# Altium schematic sheet TIDA01398_POWER_PIR.SchDoc: Power and PIR Sensor
size 431 x 279 mm; Date: Not shown in title block; ApprovedBy: Not shown in title block; CheckedBy: Not shown in title block; Author: Not shown in title block; CompanyName: Not shown in title block; DrawnBy: David Stout; Engineer: David Stout; Organization: Not shown in title block; Address1: Not shown in title block; Address2: Not shown in title block; Address3: Not shown in title block; Address4: Not shown in title block; DocumentNumber: 1; Revision: Use project parameter SCH_Rev; SheetNumber: 2; SheetTotal: 4; PageSetup: Record=PageOptions|CenterHorizontal=True|CenterVertical=True|PrintScale=0.62|XCorrection=1.00|YCorrection=1.00|PrintKind=0|BorderSize=5000000|LeftOffset=0|BottomOffset=0|Orientation=2|PaperLength=1000|PaperWidth=1000|Scale=100|PaperSource=15|PrintQuality=600|MediaType=1|DitherType=10|PrintScaleMode=1|PaperKind=Letter (8.5 x 11")|PaperIndex=1; CurrentTime: Not shown in title block; CurrentDate: Not shown in title block; Time: Not shown in title block; DocumentFullPathAndName: Not shown in title block; DocumentName: Not shown in title block; ModifiedDate: Not shown in title block; ImagePath: Not shown in title block
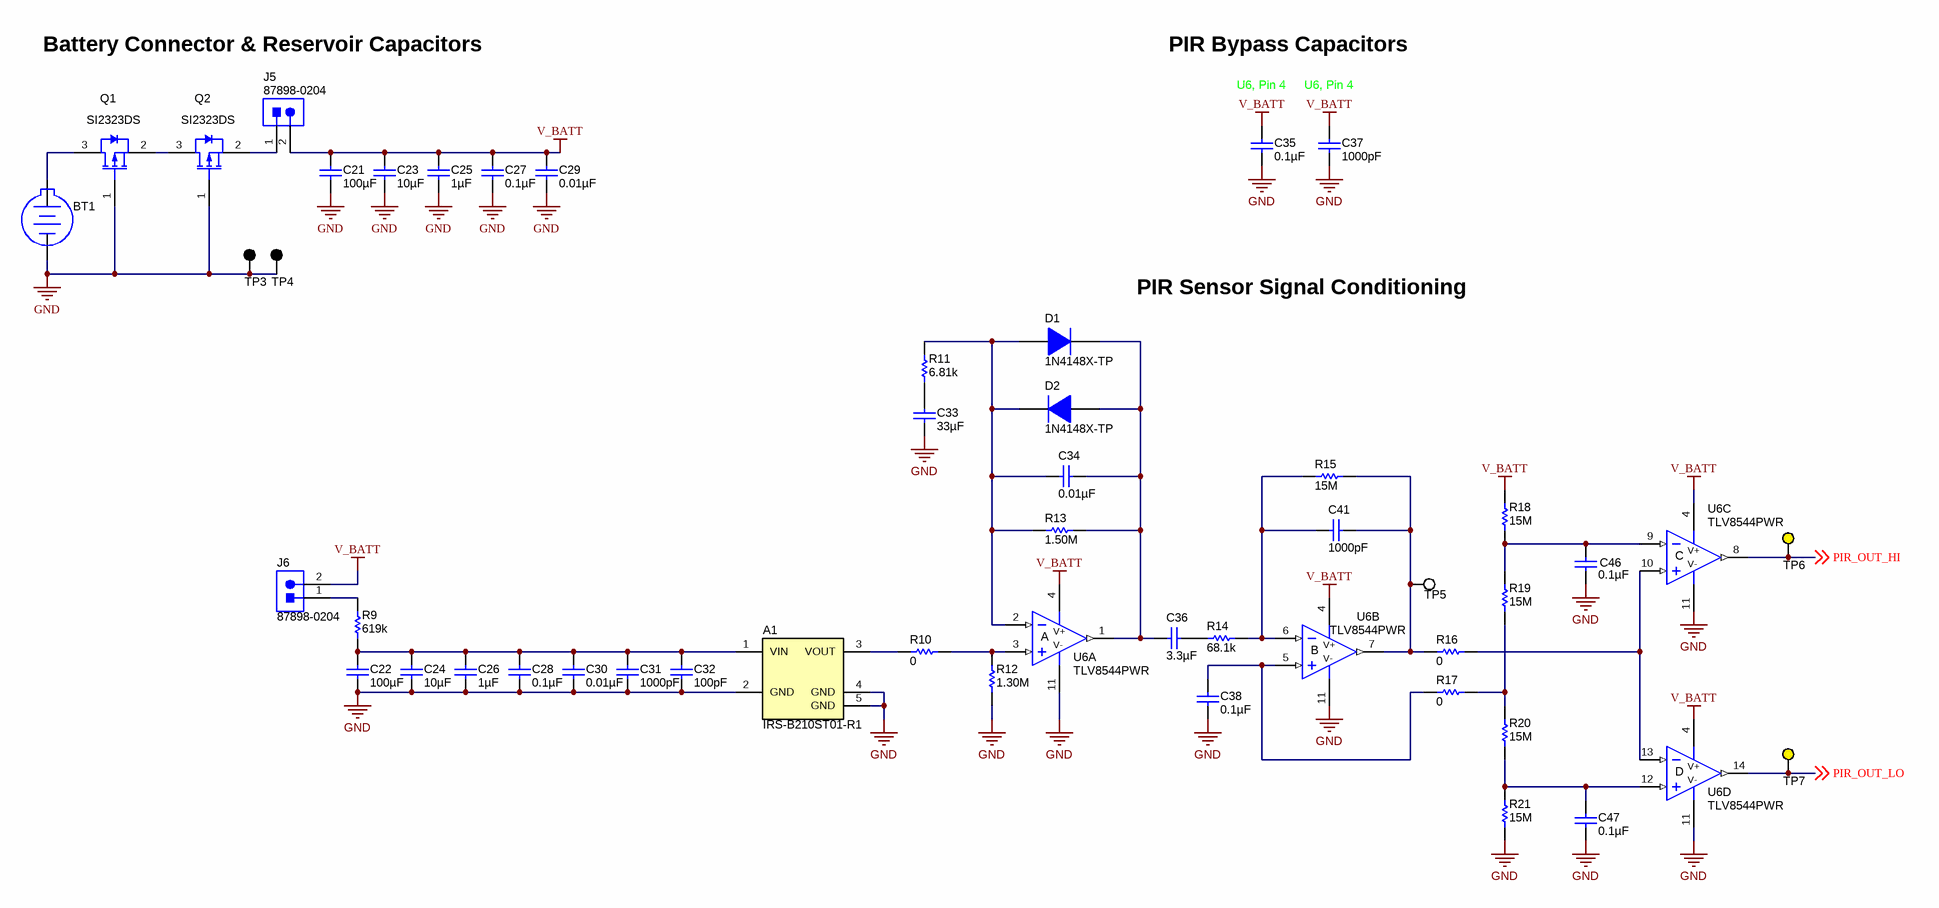
[diagram p0: TIDA01398_POWER_PIR.SchDoc]

## Parts
A1  IRS-B210ST01-R1  [Murata_IRS-B210ST01]
BT1  BS-7  [BAT_BS-7]  (value not drawn)
C21  ValueDisplayed: 100µF  [1206_190]  (hidden comment: C3216X5R1A107M160AC)
C22  ValueDisplayed: 100µF  [1206_190]  (hidden comment: C3216X5R1A107M160AC)
C23  ValueDisplayed: 10µF  [0603]  (hidden comment: C1608X5R0J106M)
C24  ValueDisplayed: 10µF  [0402]  (hidden comment: GRM155R60J106ME44D)
C25  ValueDisplayed: 1µF  [0603]  (hidden comment: C1608X7R1C105K)
C26  ValueDisplayed: 1µF  [0402]  (hidden comment: C1005X5R1A105K050BB)
C27  ValueDisplayed: 0.1µF  [0402]  (hidden comment: C1005X7R1H104K050BB)
C28  ValueDisplayed: 0.1µF  [0402]  (hidden comment: C1005X7R1H104K050BB)
C29  ValueDisplayed: 0.01µF  [0402]  (hidden comment: C1005X7R1C103K050BA)
C30  ValueDisplayed: 0.01µF  [0402]  (hidden comment: C1005X7R1C103K050BA)
C31  ValueDisplayed: 1000pF  [0402]  (hidden comment: C1005X7R1H102K)
C32  ValueDisplayed: 100pF  [0402]  (hidden comment: C0402C101J3GACTU)
C33  ValueDisplayed: 33µF  [0805_HV]  (hidden comment: C2012X5R1A336M125AC)
C34  ValueDisplayed: 0.01µF  [0402]  (hidden comment: C1005X7R1E103K)
C35  ValueDisplayed: 0.1µF  [0402]  (hidden comment: C1005X7R1H104K)
C36  ValueDisplayed: 3.3µF  [0402]  (hidden comment: C1005X5R1A335K050BC)
C37  ValueDisplayed: 1000pF  [0402]  (hidden comment: C1005X7R1H102K)
C38  ValueDisplayed: 0.1µF  [0402]  (hidden comment: C1005X7R1H104K)
C41  ValueDisplayed: 1000pF  [0402]  (hidden comment: C1005C0G1E102J)
C46  ValueDisplayed: 0.1µF  [0402]  (hidden comment: C1005X7R1H104K)
C47  ValueDisplayed: 0.1µF  [0402]  (hidden comment: C1005X7R1H104K)
D1  1N4148X-TP  [SOD-523]
D2  1N4148X-TP  [SOD-523]
J5  87898-0204  [Molex_87898-0204]
J6  87898-0204  [Molex_87898-0204]
Q1  SI2323DS  [SOT-23]
Q2  SI2323DS  [SOT-23]
R9  ValueDisplayed: 619k  [0402]  (hidden comment: CRCW0402619KFKED)
R10  ValueDisplayed: 0  [0402]  (hidden comment: CRCW04020000Z0ED)
R11  ValueDisplayed: 6.81k  [0402]  (hidden comment: CRCW04026K81FKED)
R12  ValueDisplayed: 1.30M  [0402]  (hidden comment: CRCW04021M30FKED)
R13  ValueDisplayed: 1.50M  [0402]  (hidden comment: CRCW04021M50FKED)
R14  ValueDisplayed: 68.1k  [0402]  (hidden comment: CRCW040268K1FKED)
R15  ValueDisplayed: 15M  [0805_HV]  (hidden comment: RMCF0805JT15M0)
R16  ValueDisplayed: 0  [0402]  (hidden comment: CRCW04020000Z0ED)
R17  ValueDisplayed: 0  [0402]  (hidden comment: CRCW04020000Z0ED)
R18  ValueDisplayed: 15M  [0805_HV]  (hidden comment: RMCF0805JT15M0)
R19  ValueDisplayed: 15M  [0805_HV]  (hidden comment: RMCF0805JT15M0)
R20  ValueDisplayed: 15M  [0805_HV]  (hidden comment: RMCF0805JT15M0)
R21  ValueDisplayed: 15M  [0805_HV]  (hidden comment: RMCF0805JT15M0)
TP3  5001  [Keystone5001]  (value not drawn)
TP4  5001  [Keystone5001]  (value not drawn)
TP5  5015  [Testpoint_Keystone_Miniature]  (value not drawn)
TP6  5004  [Keystone5004]  (value not drawn)
TP7  5004  [Keystone5004]  (value not drawn)
U6  TLV8544PWR  [PW0014A_N]  (parts A,B,C,D of 4)

## Nets
GND: A1.2(GND) A1.4(GND) A1.5(GND) BT1.2(-) C21.2 C22.2 C23.2 C24.2 C25.2 C26.2 C27.2 C28.2 C29.2 C30.2 C31.2 C32.2 C33.2 C35.1 C37.2 C38.2 C46.2 C47.2 Q1.1(G) Q2.1(G) R12.1 R21.1 TP3.1 TP4.1 U6.11(V-)
V_BATT: C21.1 C23.1 C25.1 C27.1 C29.1 C35.2 C37.1 J5.2 J6.2 R18.2 U6.4(V+)
PIR_OUT_HI: TP6.1 U6.8(OUT) ; off-sheet PIR_OUT_HI
PIR_OUT_LO: TP7.1 U6.14(OUT) ; off-sheet PIR_OUT_LO
NetA1_1: A1.1(VIN) C22.1 C24.1 C26.1 C28.1 C30.1 C31.1 C32.1 R9.1
NetA1_3: A1.3(VOUT) R10.1
NetBT1_1: BT1.1(+) Q1.3(D)
NetC33_1: C33.1 R11.1
NetC34_1: C34.1 C36.2 D1.1(K) D2.2(A) R13.2 U6.1(OUT)
NetC34_2: C34.2 D1.2(A) D2.1(K) R11.2 R13.1 U6.2(IN-)
NetC36_1: C36.1 R14.1
NetC38_1: C38.1 R17.1 U6.5(IN+)
NetC41_1: C41.1 R15.2 R16.1 TP5.1 U6.7(OUT)
NetC41_2: C41.2 R14.2 R15.1 U6.6(IN-)
NetC46_1: C46.1 R18.1 R19.2 U6.9(IN-)
NetC47_1: C47.1 R20.1 R21.2 U6.12(IN+)
NetJ5_1: J5.1 Q2.2(S)
NetJ6_1: J6.1 R9.2
NetQ1_2: Q1.2(S) Q2.3(D)
NetR10_2: R10.2 R12.2 U6.3(IN+)
NetR16_2: R16.2 U6.10(IN+) U6.13(IN-)
NetR17_2: R17.2 R19.1 R20.2

## Notes on the sheet
- Battery Connector & Reservoir Capacitors
- PIR Bypass Capacitors
- U6, Pin 4
- PIR Sensor Signal Conditioning
- Drawn By:
- SVN Rev:
- Number:
- TID #:
- Orderable:
- Rev:
- Sheet Title:
- File:
- Project Title:
- Designed for:
- Assembly Variant:
- Mod. Date:
- Sheet:
- Size:
- of
- B
- http://www.ti.com
- Texas Instruments and/or its licensors do not warrant the accuracy or completeness of this specification or any information contained therein. Texas Instruments and/or its licensors do not warrant that this design will meet the specifications, will be suitable for your application or fit for any particular purpose, or will operate in an implementation. Texas Instruments and/or its licensors do not warrant that the design is production worthy. You should completely validate and test your design implementation to confirm the system functionality for your application.
- Engineer:
- Contact:
- © Texas Instruments
- (in symbol TLV8544PWR, part A) A
- (in symbol TLV8544PWR, part B) B
- (in symbol TLV8544PWR, part C) C
- (in symbol TLV8544PWR, part D) D

## Library data of the parts
A1 = IRS-B210ST01-R1: Pyroelectric Infrared Sensors for Reflow Soldering, 3.6mVp-p, SMD; Manufacturer: MuRata; SymbolCreator: Altium; CompType: SENSOR; SymbolVersion: 2015-10-22; PartNumber: IRS-B210ST01-R1; Value: 3.6mVp-p; MountType: SMT; ComponentLink1Description: Datasheet Link; ComponentLink1URL: http://www.murata.com/~/media/webrenewal/support/library/catalog/products/sensor/infrared/s21e.ashx; RoHS: Y; PackageReference: 4.7x4.7mm; Publisher: Texas Instruments; LatestRevisionDate: 2015-11-11; Supplier 1: Digi-Key; Supplier Part Number 1: IRS-B210ST01-R1-ND; Supplier 2: Mouser; Supplier Part Number 2: 81-IRS-B210ST01-R1
BT1 = BS-7: Battery Holder, CR2032, Retainer clip, TH; Manufacturer: Memory Protection Devices; SymbolCreator: a0412235; SymbolVersion: 2013-01-08; CompType: Battery Holder; PartNumber: BS-7; RoHS: Y; PackageReference: CR2032 holder; MountType: TH; ComponentLink1Description: Datasheet Link; ComponentLink1URL: http://www.memoryprotectiondevices.com/datasheets/BS-7-datasheet.pdf; Publisher: Texas Instruments; LatestRevisionDate: 2015-08-27; Supplier 1: Digi-Key; Supplier Part Number 1: BS-7-ND
C21 C22 = C3216X5R1A107M160AC: CAP, CERM, 100 µF, 10 V, +/- 20%, X5R, 1206_190; Manufacturer: TDK; Polarized: N; CompType: Capacitor; Value: 100uF; U/M: EA; Cap_F: 0.0001; Tolerance_%: 20; Value1: Unknown; VDC_V: 10; Value2: 10V; TaMin_C: -55; TaMax_C: 85; Cap_Case: 1206; AEC Category: Q200; SymbolVersion: 2008-07-09; PartNumber: C3216X5R1A107M160AC; PackageReference: 1206_190; RoHS: Y; MountType: SMT; Publisher: Texas Instruments; LatestRevisionDate: 2015-08-30; ComponentLink1Description: Datasheet link; ComponentLink1URL: http://www.tdk.com/pdf/TDKMLCCCapRange.pdf; Technology: Ceramic; TempCo: X5R; Published: 2008-06-19; Supplier 1: Digi-Key; Supplier Part Number 1: 445-6007-1-ND; Supplier 2: Mouser; Supplier Part Number 2: 810-C3216X5R1A107M; Supplier 3: Farnell; Supplier Part Number 3: 2354212; AEC Qualified: ?
C23 = C1608X5R0J106M: CAP, CERM, 10 µF, 6.3 V, +/- 20%, X5R, 0603; Manufacturer: TDK; Polarized: N; CompType: Capacitor; Value: 10uF; U/M: EA; Cap_F: 0.00001; Tolerance_%: 20; ESR_ohm: 0.005; Value1: 0.005 ohm; VDC_V: 6.3; Value2: 6.3V; IRMS_A: 1.9; TaMin_C: -25; TaMax_C: 85; AEC Category: Q200; SymbolVersion: 2008-07-09; PartNumber: C1608X5R0J106M; PackageReference: 0603; RoHS: Y; MountType: SMT; Technology: Ceramic; TempCo: X5R; Cap_Case: 0603; Published: 2008-06-19; Publisher: Texas Instruments; LatestRevisionDate: 2015-08-30; ComponentLink1Description: Datasheet link; ComponentLink1URL: http://www.tdk.co.jp/tefe02/e412_c.pdf; Supplier 1: Digi-Key; Supplier Part Number 1: 445-4112-1-ND; Supplier 2: Farnell; Supplier Part Number 2: 1844199; AEC Qualified: ?
C24 = GRM155R60J106ME44D: CAP, CERM, 10 µF, 6.3 V, +/- 20%, X5R, 0402; Manufacturer: MuRata; Polarized: N; CompType: Capacitor; Value: 10uF; U/M: EA; Cap_F: 0.00001; Tolerance_%: 20; Value1: Unknown; VDC_V: 6.3; Value2: 6.3V; TaMin_C: -55; TaMax_C: 85; AEC Category: Q200; SymbolVersion: 2008-07-09; PartNumber: GRM155R60J106ME44D; PackageReference: 0402; RoHS: Y; MountType: SMT; Technology: Ceramic; TempCo: X5R; Cap_Case: 0402; Published: 2008-06-19; Publisher: Texas Instruments; LatestRevisionDate: 2015-08-30; ComponentLink1Description: Datasheet link; ComponentLink1URL: https://sps06.itg.ti.com/sites/KMS/crossdivteams/altium/docs/ComponentDatasheets/grm155r60j106me44d.pdf; Supplier 1: Mouser; Supplier Part Number 1: 81-GRM155R60J106ME4D; AEC Qualified: ?
C25 = C1608X7R1C105K: CAP, CERM, 1 µF, 16 V, +/- 10%, X7R, 0603; Manufacturer: TDK; Polarized: N; CompType: Capacitor; Value: 1uF; U/M: EA; Cap_F: 0.000001; Tolerance_%: 10; ESR_ohm: 0.0057; Value1: 0.0057 ohm; VDC_V: 16; Value2: 16V; TaMin_C: -55; TaMax_C: 125; AEC Category: Q200; SymbolVersion: 2008-07-09; PartNumber: C1608X7R1C105K; PackageReference: 0603; RoHS: Y; MountType: SMT; Technology: Ceramic; TempCo: X7R; Cap_Case: 0603; Published: 2008-06-19; Publisher: Texas Instruments; LatestRevisionDate: 2015-08-30; ComponentLink1Description: Datasheet link; ComponentLink1URL: http://www.tdk.co.jp/tefe02/e412_c.pdf; Supplier 1: Digi-Key; Supplier Part Number 1: 445-1604-1-ND; Supplier 2: Farnell; Supplier Part Number 2: 1907343; AEC Qualified: ?
C26 = C1005X5R1A105K050BB: CAP, CERM, 1 µF, 10 V, +/- 10%, X5R, 0402; Manufacturer: TDK; Polarized: N; CompType: Capacitor; Value: 1uF; U/M: EA; Cap_F: 0.000001; Tolerance_%: 10; Value1: Unknown; Value2: 10V; TaMin_C: -55; TaMax_C: 85; AEC Category: Q200; SymbolVersion: 2008-07-09; PartNumber: C1005X5R1A105K050BB; PackageReference: 0402; RoHS: Y; VDC_V: 10; MountType: SMT; Technology: Ceramic; TempCo: X5R; Cap_Case: 0402; Published: 2008-06-19; Publisher: Texas Instruments; LatestRevisionDate: 2015-08-30; ComponentLink1Description: Datasheet link; ComponentLink1URL: http://product.tdk.com/en/catalog/datasheets/mlcc_commercial_general_en.pdf; Supplier 1: Digi-Key; Supplier Part Number 1: 445-4114-1-ND; Supplier 2: Mouser; Supplier Part Number 2: 810-C1005X5R1A105K; Supplier 3: Farnell; Supplier Part Number 3: 2371912; AEC Qualified: ?
C27 C28 = C1005X7R1H104K050BB: CAP, CERM, 0.1 µF, 50 V, +/- 10%, X7R, 0402; Manufacturer: TDK; Polarized: N; CompType: Capacitor; Value: 0.1uF; U/M: EA; Cap_F: 0.0000001; Tolerance_%: 10; Value1: Unknown; VDC_V: 50; Value2: 50V; TaMin_C: -55; TaMax_C: 125; AEC Category: Q200; SymbolVersion: 2008-07-09; PartNumber: C1005X7R1H104K050BB; PackageReference: 0402; RoHS: Y; MountType: SMT; Technology: Ceramic; TempCo: X7R; Cap_Case: 0402; Published: 2008-06-19; Publisher: Texas Instruments; LatestRevisionDate: 2015-08-30; ComponentLink1Description: Datasheet link; ComponentLink1URL: http://product.tdk.com/capacitor/mlcc/en/documents/mlcc_commercial_general_en.pdf; Supplier 1: Digi-Key; Supplier Part Number 1: 445-5932-1-ND; Supplier 2: Mouser; Supplier Part Number 2: 810-C1005X7R1H104K; AEC Qualified: ?
C29 C30 = C1005X7R1C103K050BA: CAP, CERM, 0.01 µF, 16 V, +/- 10%, X7R, 0402; Manufacturer: TDK; Polarized: N; CompType: Capacitor; Value: 0.01uF; U/M: EA; Cap_F: 0.00000001; Tolerance_%: 10; ESR_ohm: 0.0623; Value1: 0.0623 ohm; VDC_V: 16; Value2: 16V; TaMin_C: -55; TaMax_C: 125; AEC Category: Q200; SymbolVersion: 2008-07-09; PartNumber: C1005X7R1C103K050BA; PackageReference: 0402; RoHS: Y; MountType: SMT; Technology: Ceramic; TempCo: X7R; Cap_Case: 0402; Published: 2008-06-19; Publisher: Texas Instruments; LatestRevisionDate: 2016-01-22; ComponentLink1Description: Datasheet link; ComponentLink1URL: http://www.tdk.co.jp/tefe02/e412_c.pdf; Supplier 1: Digi-Key; Supplier Part Number 1: 445-1262-1-ND; Supplier 2: Farnell; Supplier Part Number 2: 1844125; AEC Qualified: N; AEC Grade: N/A
C31 C37 = C1005X7R1H102K: CAP, CERM, 1000 pF, 50 V, +/- 10%, X7R, 0402; Manufacturer: TDK; Polarized: N; CompType: Capacitor; Value: 1000pF; U/M: EA; Cap_F: 0.000000001; Tolerance_%: 10; ESR_ohm: 0.2381; Value1: 0.2381 ohm; VDC_V: 50; Value2: 50V; TaMin_C: -55; TaMax_C: 125; AEC Category: Q200; SymbolVersion: 2008-07-09; PartNumber: C1005X7R1H102K; PackageReference: 0402; RoHS: Y; MountType: SMT; Technology: Ceramic; TempCo: X7R; Cap_Case: 0402; Published: 2008-06-19; Publisher: Texas Instruments; LatestRevisionDate: 2015-08-30; ComponentLink1Description: Datasheet link; ComponentLink1URL: http://www.tdk.co.jp/tefe02/e412_c.pdf; Supplier 1: Digi-Key; Supplier Part Number 1: 445-1256-1-ND; Supplier 2: Farnell; Supplier Part Number 2: 1907278; AEC Qualified: ?
C32 = C0402C101J3GACTU: CAP, CERM, 100 pF, 25 V, +/- 5%, C0G/NP0, 0402; Manufacturer: Kemet; Polarized: N; CompType: Capacitor; Value: 100pF; U/M: EA; Cap_F: 0.0000000001; Tolerance_%: 5; Value1: Unknown; VDC_V: 25; Value2: 25V; TaMin_C: -55; TaMax_C: 125; AEC Category: Q200; SymbolVersion: 2008-07-09; PartNumber: C0402C101J3GACTU; PackageReference: 0402; RoHS: Y; MountType: SMT; Technology: Ceramic; TempCo: C0G/NP0; Cap_Case: 0402; Published: 2008-06-19; Publisher: Texas Instruments; LatestRevisionDate: 2015-08-30; ComponentLink1Description: Datasheet link; ComponentLink1URL: http://capacitoredge.kemet.com/capedge2/DataSheet/Datasheet-C0402C101J3GACTU.pdf?pn=C0402C101J3GACTU; Supplier 1: Digi-Key; Supplier Part Number 1: 399-1022-1-ND; Supplier 2: Mouser; Supplier Part Number 2: 80-C0402C101J3G; Supplier 3: Farnell; Supplier Part Number 3: 2392118; AEC Qualified: N; AEC Grade: N/A
C33 = C2012X5R1A336M125AC: CAP, CERM, 33 µF, 10 V, +/- 20%, X5R, 0805; Manufacturer: TDK; Polarized: N; CompType: Capacitor; Value: 33uF; U/M: EA; Cap_F: 0.000033; Tolerance_%: 20; Value1: Unknown; VDC_V: 10; Value2: 10V; TaMin_C: -55; TaMax_C: 85; Cap_Case: 0805; AEC Category: Q200; SymbolVersion: 2008-07-09; PartNumber: C2012X5R1A336M125AC; PackageReference: 0805; RoHS: Y; MountType: SMT; Technology: Ceramic; TempCo: X5R; Published: 2008-06-19; Publisher: Texas Instruments; LatestRevisionDate: 2016-01-22; ComponentLink1Description: Datasheet link; ComponentLink1URL: http://product.tdk.com/en/catalog/datasheets/mlcc_commercial_general_en.pdf; Supplier 1: Digi-Key; Supplier Part Number 1: 445-8238-1-ND; AEC Qualified: N; AEC Grade: N/A
C34 = C1005X7R1E103K: CAP, CERM, 0.01 µF, 25 V, +/- 10%, X7R, 0402; Manufacturer: TDK; Polarized: N; CompType: Capacitor; Value: 0.01uF; U/M: EA; Cap_F: 0.00000001; Tolerance_%: 10; ESR_ohm: 0.0623; Value1: 0.0623 ohm; VDC_V: 25; Value2: 25V; TaMin_C: -55; TaMax_C: 125; AEC Category: Q200; SymbolVersion: 2008-07-09; PartNumber: C1005X7R1E103K; PackageReference: 0402; RoHS: Y; MountType: SMT; Technology: Ceramic; TempCo: X7R; Cap_Case: 0402; Published: 2008-06-19; Publisher: Texas Instruments; LatestRevisionDate: 2015-08-30; ComponentLink1Description: Datasheet link; ComponentLink1URL: http://www.tdk.co.jp/tefe02/e412_c.pdf; Supplier 1: Digi-Key; Supplier Part Number 1: 445-1260-1-ND; Supplier 2: Farnell; Supplier Part Number 2: 1844133; AEC Qualified: ?
C35 C38 C46 C47 = C1005X7R1H104K: CAP, CERM, 0.1 µF, 50 V, +/- 10%, X7R, 0402; Manufacturer: TDK; Polarized: N; CompType: Capacitor; Value: 0.1uF; U/M: EA; Cap_F: 0.0000001; Tolerance_%: 10; Value1: Unknown; VDC_V: 50; Value2: 50V; TaMin_C: -55; TaMax_C: 125; AEC Category: Q200; SymbolVersion: 2008-07-09; PartNumber: C1005X7R1H104K; PackageReference: 0402; RoHS: Y; MountType: SMT; Technology: Ceramic; TempCo: X7R; Cap_Case: 0402; Published: 2008-06-19; Publisher: Texas Instruments; LatestRevisionDate: 2015-08-30; ComponentLink1Description: Datasheet link; Supplier 1: Digi-Key; Supplier Part Number 1: 445-5932-1-ND; Supplier 2: Farnell; Supplier Part Number 2: 1907278; AEC Qualified: ?
C36 = C1005X5R1A335K050BC: CAP, CERM, 3.3 µF, 10 V, +/- 10%, X5R, 0402; Manufacturer: TDK; Polarized: N; CompType: Capacitor; Value: 3.3uF; U/M: EA; Cap_F: 0.0000033; Tolerance_%: 10; Value1: Unknown; Value2: 10V; TaMin_C: -55; TaMax_C: 85; AEC Category: Q200; SymbolVersion: 2008-07-09; PartNumber: C1005X5R1A335K050BC; PackageReference: 0402; RoHS: Y; VDC_V: 10; MountType: SMT; Technology: Ceramic; TempCo: X5R; Cap_Case: 0402; Published: 2008-06-19; Publisher: Texas Instruments; LatestRevisionDate: 2015-08-30; ComponentLink1Description: Datasheet link; ComponentLink1URL: http://product.tdk.com/en/catalog/datasheets/mlcc_commercial_general_en.pdf; Supplier 1: Digi-Key; Supplier Part Number 1: 445-13819-1-ND; AEC Qualified: ?
C41 = C1005C0G1E102J: CAP, CERM, 1000 pF, 25 V, +/- 5%, C0G/NP0, 0402; Manufacturer: TDK; Polarized: N; CompType: Capacitor; Value: 1000pF; U/M: EA; Cap_F: 0.000000001; Tolerance_%: 5; Value1: Unknown; VDC_V: 25; Value2: 25V; TaMin_C: -55; TaMax_C: 125; AEC Category: Q200; SymbolVersion: 2008-07-09; PartNumber: C1005C0G1E102J; PackageReference: 0402; RoHS: Y; MountType: SMT; Technology: Ceramic; TempCo: C0G/NP0; Cap_Case: 0402; Published: 2008-06-19; Publisher: Texas Instruments; LatestRevisionDate: 2015-08-30; ComponentLink1Description: Datasheet link; ComponentLink1URL: http://www.tdk.co.jp/tefe02/e412_c.pdf; Supplier 1: Digi-Key; Supplier Part Number 1: 445-2651-1-ND; Supplier 2: Farnell; Supplier Part Number 2: 1844079; AEC Qualified: ?
D1 D2 = 1N4148X-TP: Diode, Switching, 75 V, 0.3 A, SOD-523; Manufacturer: Micro Commercial Components; U/M: EA; Vf_V: 1.25; Value: 75V; Value1: 0.3A; Value2: 1.25V; Io_A: 0.3; Vr_V: 75; TJmax_C: 150; AEC Category: Q101; SymbolVersion: 2008-12-08; PartNumber: 1N4148X-TP; PackageReference: SOD-523; CompType: Diode; MountType: SMT; Type: Switching; RoHS: Y; Published: 2008-06-26; Publisher: Texas Instruments; LatestRevisionDate: 2015-08-27; ComponentLink1Description: Datasheet link; ComponentLink1URL: http://www.mccsemi.com/up_pdf/1N4148X(SOD-523).PDF; Supplier 1: Digi-Key; Supplier Part Number 1: 1N4148XTPMSCT-ND; Supplier 2: Mouser; Supplier Part Number 2: 833-1N4148X-TP; Supplier 3: Newark; Supplier Part Number 3: 69R6666; AEC Qualified: ?
J5 J6 = 87898-0204: Header, 2.54 mm, 2x1, Gold, R/A, SMT; Manufacturer: Molex; SymbolCreator: a0412235; U/M: EA; SymbolVersion: 2013-10-31; PartNumber: 87898-0204; ClassName: Header; PackageReference: Header, 2.54 mm, 2x1, R/A, SMT; CompType: Header; RoHS: Y; MountType: SMT; ComponentLink1Description: Datasheet Link; ComponentLink1URL: http://www.molex.com/pdm_docs/sd/878980204_sd.pdf; Publisher: Texas Instruments; LatestRevisionDate: 2015-08-17; Supplier 1: Digi-Key; Supplier Part Number 1: WM9852-ND; Supplier 2: Mouser; Supplier Part Number 2: 538-87898-0204
Q1 Q2 = SI2323DS: MOSFET, P-CH, -20 V, -3.7 A, SOT-23; Manufacturer: Vishay-Siliconix; Alternate Manufacturer: None; U/M: EA; ChType: P; Value: -20V; Value1: 0.031 ohm; Rdson45_ohm: 0.031; Value2: 12.5 nC; QgTyp_nC: 12.5; Vgs_V: -8; AEC Category: Q101; SymbolVersion: 2008-07-09; PartNumber: SI2323DS; PackageReference: SOT-23; CompType: MOSFET; VdsMax_V: -20; IdsMax_A: -3.7; RoHS: Y; MountType: SMT; Published: 2008-06-19; Publisher: Texas Instruments; LatestRevisionDate: 2015-11-11; LatestRevisionNote: Added parts.; ComponentLink1Description: Datasheet link; ComponentLink1URL: http://www.vishay.com/docs/72024/72024.pdf; AEC Qualified: ?
R9 = CRCW0402619KFKED: RES, 619 k, 1%, 0.063 W, 0402; Manufacturer: Vishay-Dale; CompType: Resistor; Value: 619k; Res_ohm: 619000; Tolerance_%: 1; Power_W: 0.063; Value2: 0.063W; VDC_V: 50; TempCo: 100 ppm/C; EIA_Code: E96; U/M: EA; AEC Category: Q200; SymbolVersion: 2009-05-29; PartNumber: CRCW0402619KFKED; PackageReference: 0402; RoHS: Y; Value_Code: 619k; Value1: 1%; MountType: SMT; Technology: Thick Film; Published: 2008-06-26; Publisher: Texas Instruments; LatestRevisionDate: 2015-08-22; ComponentLink1Description: Datasheet link; ComponentLink1URL: http://www.vishay.com/docs/20035/dcrcwe3.pdf; Supplier 1: Digi-Key; Supplier Part Number 1: 541-619KLCT-ND; Supplier 2: Mouser; Supplier Part Number 2: 71-CRCW0402-619K-E3; Supplier 3: Farnell; Supplier Part Number 3: 1151415; AEC Qualified: ?
R10 R16 R17 = CRCW04020000Z0ED: RES, 0, 5%, 0.063 W, 0402; Manufacturer: Vishay-Dale; CompType: Resistor; Value: 0; Value_Code: 0000; Tolerance_%: 5; Power_W: 0.063; Value2: 0.063W; VDC_V: 50; TempCo: 200 ppm/C; EIA_Code: E24; U/M: EA; AEC Category: Q200; SymbolVersion: 2009-05-29; PartNumber: CRCW04020000Z0ED; PackageReference: 0402; RoHS: Y; Res_ohm: 0; Value1: 5%; MountType: SMT; Technology: Thick Film; Published: 2008-06-26; Publisher: Texas Instruments; LatestRevisionDate: 2015-08-22; ComponentLink1Description: Datasheet link; ComponentLink1URL: http://www.vishay.com/docs/20035/dcrcwe3.pdf; Supplier 1: Digi-Key; Supplier Part Number 1: 541-0.0JCT-ND; Supplier 2: Mouser; Supplier Part Number 2: 71-CRCW0402-0-E3; Supplier 3: Farnell; Supplier Part Number 3: 1469661; AEC Qualified: ?
R11 = CRCW04026K81FKED: RES, 6.81 k, 1%, 0.063 W, 0402; Manufacturer: Vishay-Dale; CompType: Resistor; Value: 6.81k; Res_ohm: 6810; Value_Code: 6k81; Tolerance_%: 1; Power_W: 0.063; Value2: 0.063W; VDC_V: 50; TempCo: 100 ppm/C; EIA_Code: E96; U/M: EA; AEC Category: Q200; SymbolVersion: 2009-05-29; PartNumber: CRCW04026K81FKED; PackageReference: 0402; RoHS: Y; Value1: 1%; MountType: SMT; Technology: Thick Film; Published: 2008-06-26; Publisher: Texas Instruments; LatestRevisionDate: 2015-08-22; ComponentLink1Description: Datasheet link; ComponentLink1URL: http://www.vishay.com/docs/20035/dcrcwe3.pdf; Supplier 1: Digi-Key; Supplier Part Number 1: 541-6.81KLCT-ND; Supplier 2: Mouser; Supplier Part Number 2: 71-CRCW0402-6.81K-E3; Supplier 3: Farnell; Supplier Part Number 3: 1652819; AEC Qualified: ?
R12 = CRCW04021M30FKED: RES, 1.30 M, 1%, 0.063 W, 0402; Manufacturer: Vishay-Dale; CompType: Resistor; Value: 1.30Meg; Res_ohm: 1300000; Value_Code: 1M30; Tolerance_%: 1; Power_W: 0.063; Value2: 0.063W; VDC_V: 50; TempCo: 100 ppm/C; EIA_Code: E96; U/M: EA; AEC Category: Q200; SymbolVersion: 2009-05-29; PartNumber: CRCW04021M30FKED; PackageReference: 0402; RoHS: Y; Value1: 1%; MountType: SMT; Technology: Thick Film; Published: 2008-06-26; Publisher: Texas Instruments; LatestRevisionDate: 2015-08-22; ComponentLink1Description: Datasheet link; ComponentLink1URL: http://www.vishay.com/docs/20035/dcrcwe3.pdf; Supplier 1: Digi-Key; Supplier Part Number 1: 541-1.30MLCT-ND; Supplier 2: Mouser; Supplier Part Number 2: 71-CRCW0402-1.3M-E3; Supplier 3: Farnell; Supplier Part Number 3: 1570635; AEC Qualified: ?
R13 = CRCW04021M50FKED: RES, 1.50 M, 1%, 0.063 W, 0402; Manufacturer: Vishay-Dale; CompType: Resistor; Value: 1.50Meg; Res_ohm: 1500000; Value_Code: 1M50; Tolerance_%: 1; Power_W: 0.063; Value2: 0.063W; VDC_V: 50; TempCo: 100 ppm/C; EIA_Code: E96; U/M: EA; AEC Category: Q200; SymbolVersion: 2009-05-29; PartNumber: CRCW04021M50FKED; PackageReference: 0402; RoHS: Y; Value1: 1%; MountType: SMT; Technology: Thick Film; Published: 2008-06-26; Publisher: Texas Instruments; LatestRevisionDate: 2015-08-22; ComponentLink1Description: Datasheet link; ComponentLink1URL: http://www.vishay.com/docs/20035/dcrcwe3.pdf; Supplier 1: Digi-Key; Supplier Part Number 1: 541-1.50MLCT-ND; Supplier 2: Mouser; Supplier Part Number 2: 71-CRCW04021M50FKED; Supplier 3: Farnell; Supplier Part Number 3: 1558783; AEC Qualified: ?
R14 = CRCW040268K1FKED: RES, 68.1 k, 1%, 0.063 W, 0402; Manufacturer: Vishay-Dale; CompType: Resistor; Value: 68.1k; Res_ohm: 68100; Value_Code: 68k1; Tolerance_%: 1; Power_W: 0.063; Value2: 0.063W; VDC_V: 50; TempCo: 100 ppm/C; EIA_Code: E96; U/M: EA; AEC Category: Q200; SymbolVersion: 2009-05-29; PartNumber: CRCW040268K1FKED; PackageReference: 0402; RoHS: Y; Value1: 1%; MountType: SMT; Technology: Thick Film; Published: 2008-06-26; Publisher: Texas Instruments; LatestRevisionDate: 2015-08-22; ComponentLink1Description: Datasheet link; ComponentLink1URL: http://www.vishay.com/docs/20035/dcrcwe3.pdf; Supplier 1: Digi-Key; Supplier Part Number 1: 541-68.1KLCT-ND; Supplier 2: Mouser; Supplier Part Number 2: 71-CRCW0402-68.1K-E3; Supplier 3: Farnell; Supplier Part Number 3: 1157047; AEC Qualified: ?
R15 R18-R21 = RMCF0805JT15M0: RES, 15 M, 5%, 0.125 W, AEC-Q200 Grade 0, 0805; Manufacturer: Stackpole Electronics Inc; CompType: Resistor; Value: 15Meg; Res_ohm: 15000000; Value_Code: 15M0; Tolerance_%: 5; Power_W: 0.125; Value2: 0.125W; VDC_V: 75; TempCo: 200 ppm/C; U/M: EA; AEC Category: Q200; AEC Qualified: Y; AEC Grade: 0; SymbolVersion: 2009-05-29; PartNumber: RMCF0805JT15M0; PackageReference: 0805; RoHS: Y; Value1: 5%; MountType: SMT; Technology: Thick Film; Published: 2008-06-26; Publisher: Texas Instruments; LatestRevisionDate: 2015-08-22; ComponentLink1Description: Datasheet link; ComponentLink1URL: https://www.seielect.com/Catalog/SEI-RMCF_RMCP.pdf; Supplier 1: Digi-Key; Supplier Part Number 1: RMCF0805JT15M0CT-ND
TP3 TP4 = 5001: Test Point, Miniature, Black, TH; Manufacturer: Keystone; CompType: Test Point Loop; U/M: EA; SymbolVersion: 2008-04-04; PartNumber: 5001; Value: Black; PackageReference: Black Miniature Testpoint; RoHS: Y; MountType: TH; ComponentLink1Description: Datasheet Link; ComponentLink1URL: http://www.keyelco.com/userAssets/file/M60-2p60.pdf; Publisher: Texas Instruments; LatestRevisionDate: 2015-08-25; Supplier 1: Digi-Key; Supplier Part Number 1: 36-5001-ND
TP5 = 5015: Test Point, Miniature, SMT; Manufacturer: Keystone; CompType: Test Point Loop; U/M: EA; SymbolVersion: 2008-07-10; PartNumber: 5015; PackageReference: Testpoint_Keystone_Miniature; RoHS: Y; MountType: SMT; ComponentLink1Description: Datasheet Link; ComponentLink1URL: http://www.keyelco.com/userAssets/store/files/5015.PDF; Value: SMT; Publisher: Texas Instruments; LatestRevisionDate: 2015-08-25; Supplier 1: Digi-Key; Supplier Part Number 1: 36-5015TR-ND
TP6 TP7 = 5004: Test Point, Miniature, Yellow, TH; Manufacturer: Keystone; CompType: Test Point Loop; U/M: EA; SymbolVersion: 2008-04-04; PartNumber: 5004; PackageReference: Yellow Miniature Testpoint; RoHS: Y; MountType: TH; ComponentLink1Description: Datasheet Link; ComponentLink1URL: http://www.keyelco.com/userAssets/file/M60-2p60.pdf; Value: Yellow; Publisher: Texas Instruments; LatestRevisionDate: 2015-08-25; Supplier 1: Digi-Key; Supplier Part Number 1: 36-5004-ND
U6 = TLV8544PWR: 500 nA RRIO Nanopower Operational Amplifier, PW0014A (TSSOP-14); Alternate PartNumber: TLV8544PWT; Manufacturer: Texas Instruments; SymbolCreator: a0412235; SizeArea_mm2: 32; SizeAreaWB_mm2: 58.8; SizeX_mm: 6.4; SizeY_mm: 5; SizeZ_mm: 1.2; CompType: IC; U/M: EA; SymbolVersion: 2015-01-09; PartNumber: TLV8544PWR; PackageReference: PW0014A; PackageDescription: TSSOP-14; MountType: SMT; ComponentLink1Description: Datasheet Link; ComponentLink1URL: https://sps06.itg.ti.com/sites/KMS/crossdivteams/altium/docs/ComponentDatasheets/TLV8544_SNOSD29.pdf; Publisher: Texas Instruments; LatestRevisionDate: 2017-01-13; Alternate Manufacturer: Texas Instruments